# Altium schematic sheet TPL-transformer.SchDoc
size A3; DocumentNumber: 5; SheetNumber: 5; SheetTotal: 5; SheetDescription: TPL Transformer
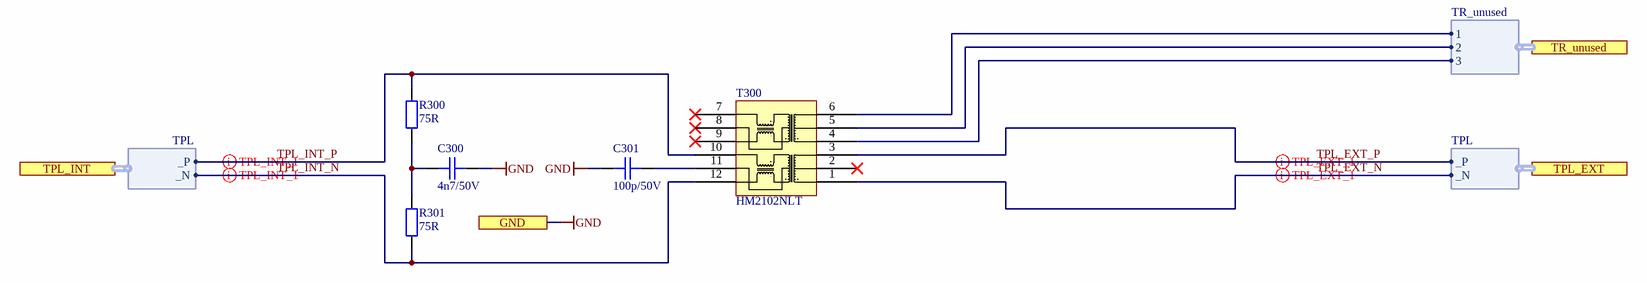
[diagram p0: TPL-transformer.SchDoc]

## Parts
C300  4n7/50V  [CAPC1608X08N]
C301  100p/50V  [CAPC1608X08N]
R300  75R  [RESC1608X05N]
R301  75R  [RESC1608X05N]
T300  HM2102NLT  [HM2102NL]

## Ports
GND, TPL_EXT (harness TPL), TPL_INT (harness TPL), TR_unused (harness TR_unused)

## Harnesses
TPL: _P, _N
TR_unused: 1, 2, 3

## Nets
GND: C300.2 C301.1 ; port GND
TPL_EXT_N: T300.1 ; port TPL_EXT._N
TPL_EXT_P: T300.3 ; port TPL_EXT._P
TPL_INT_N: R301.1 T300.12 ; port TPL_INT._N
TPL_INT_P: R300.2 T300.10 ; port TPL_INT._P
NetC300_1: C300.1 R300.1 R301.2
NetC301_2: C301.2 T300.11
NetT300_4: T300.4 ; port TR_unused.3
NetT300_5: T300.5 ; port TR_unused.2
NetT300_6: T300.6 ; port TR_unused.1

Not connected (* = marked no-connect by the designer): T300 2* 7* 8* 9*

## Layout directives
differential pair: TPL_EXT_N, TPL_EXT_P, TPL_INT_N, TPL_INT_P

## Notes on the sheet
- Fraunhofer IISB
- Schottkystr. 10
- developed by:
- 91058 Erlangen
- Germany
- Author
- Project
- License
- Description
- File
- Version
- Release Date
- Sheet
- foxbms.org <https://foxbms.org>
- www.iisb.fraunhofer.de <https://www.iisb.fraunhofer.de/>
- foxBMS Team
- /

## Library data of the parts
C300 = gen_C_ceramic_4n7_50V_X7R_0603: MLCC; Capacitance: 4n7; Rated Voltage: 50V; Dielectric: X7R; Case EIA: 0603; Case Metric: 1608; PnP Package: 0603C; Automotive Qualified: True; Part Number: gen_C_ceramic_4n7_50V_X7R_0603; Supplier 1: Farnell; Supplier Part Number 1: 2904754
C301 = gen_C_ceramic_100p_50V_C0G_0603: MLCC; Capacitance: 100p; Rated Voltage: 50V; Dielectric: C0G; Tolerance: ± 10%; Case EIA: 0603; Case Metric: 1608; PnP Package: 0603C; PnP Value: 100pF/50V/NP0; PnP equipped: x; Automotive Qualified: True; AEC-Q Norm: AEC-Q200; Part Number: gen_C_ceramic_100p_50V_C0G_0603; Supplier 1: Farnell; Supplier Part Number 1: 2478236; ECCN: EAR99
R300 R301 = gen_R_75R_0603: SMD Resistor 75R 0603; Tolerance: 1%; Power: 0.1W; Case EIA: 0603; Case Metric: 1608; Maximum Working Voltage: 75V; PnP Package: 0603R; Automotive Qualified: True; AEC-Q Grade: Grade 0; AEC-Q Norm: AEC-Q200; Part Number: gen_R_75R_0603; Operating Temperature: -55°C - +155°C; Resistance: 75R; Series: E24, E96; PnP Value: 75R; ECCN: EAR99; Supplier 1: Mouser; Supplier Part Number 1: 667-ERJ-UP3F75R0V
T300 = HM2102NLT: Pulse HM2102NLT BMS Transformer; Automotive Qualified: True; AEC-Q Norm: AEC-Q200; Part Number: HM2102NLT; Manufacturer: Pulse; Operating Temperature: -40°C - +125°C; ComponentLink1Description: Datasheet; ComponentLink1URL: https://www.mouser.de/datasheet/2/336/HM2102NL-1218600.pdf; Supplier 1: Mouser; Supplier Part Number 1: 673-HM2102NLT; Supplier 2: Digikey; Supplier Part Number 2: 1840-1034-1-ND; ECCN: EAR99